# EAGLE design Sensors_v1.0 (EAGLE 7.7.0)

## Sheet 1 of 5
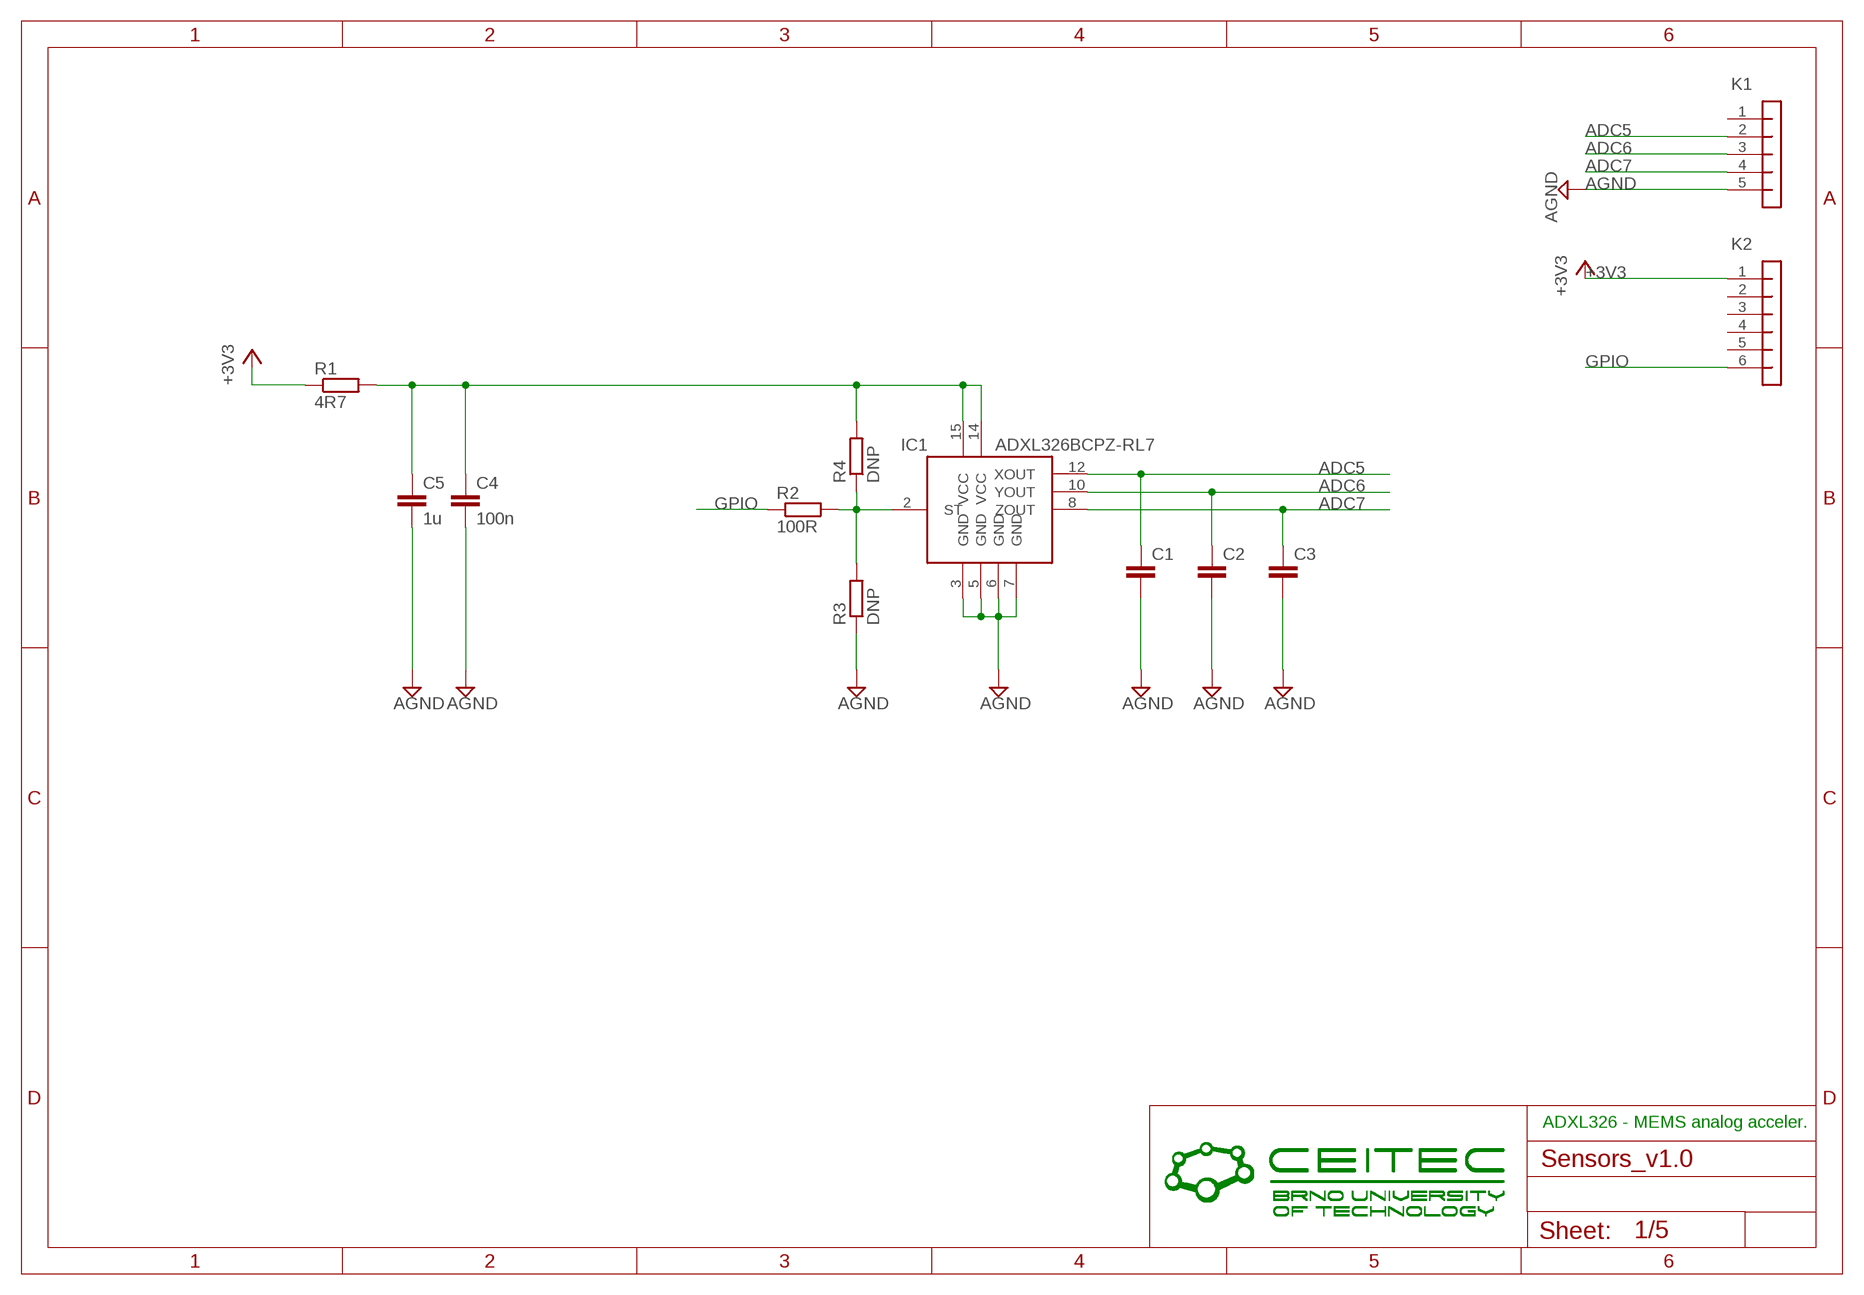
[diagram p0: schematic, sheet 1]

### Parts
C1  C-EUC0805K  [C0805K]
C2  C-EUC0805K  [C0805K]
C3  C-EUC0805K  [C0805K]
C4  100n  C-EUC0805K  [C0805K]
C5  1u  C-EUC0805K  [C0805K]
IC1  ADXL326BCPZ-RL7  ADXL326  [LFCSP-LQ-16]
K1  PIN_1X5_1.27THT  [PINHEAD_1X5_RM1.27THT]
K2  PIN_1X6_1.27THT  [PINHEAD_1X6_RM1.27THT]
R1  4R7  R-EU_M0805  [M0805]
R2  100R  R-EU_M0805  [M0805]
R3  DNP  R-EU_M0805  [M0805]
R4  DNP  R-EU_M0805  [M0805]

### Nets
+3V3: K2.1 R1.1 ; also sheet 2,3,4,5
ADC5: C1.1 IC1.12(XOUT) K1.2 ; also sheet 4
ADC6: C2.1 IC1.10(YOUT) K1.3 ; also sheet 4
ADC7: C3.1 IC1.8(ZOUT) K1.4 ; also sheet 4
AGND: C1.2 C2.2 C3.2 C4.2 C5.2 IC1.3(GND) IC1.5(GND) IC1.6(GND) IC1.7(GND) K1.5 R3.1 ; also sheet 4
GPIO: K2.6 R2.1 ; also sheet 2,3
N$1: C4.1 C5.1 IC1.14(VCC) IC1.15(VCC) R1.2 R4.2
N$2: IC1.2(ST) R2.2 R3.2 R4.1
Unconnected: K1.1 K2.2 K2.3 K2.4 K2.5

### Notes on the sheet
- ADXL326 - MEMS analog acceler.

## Sheet 2 of 5
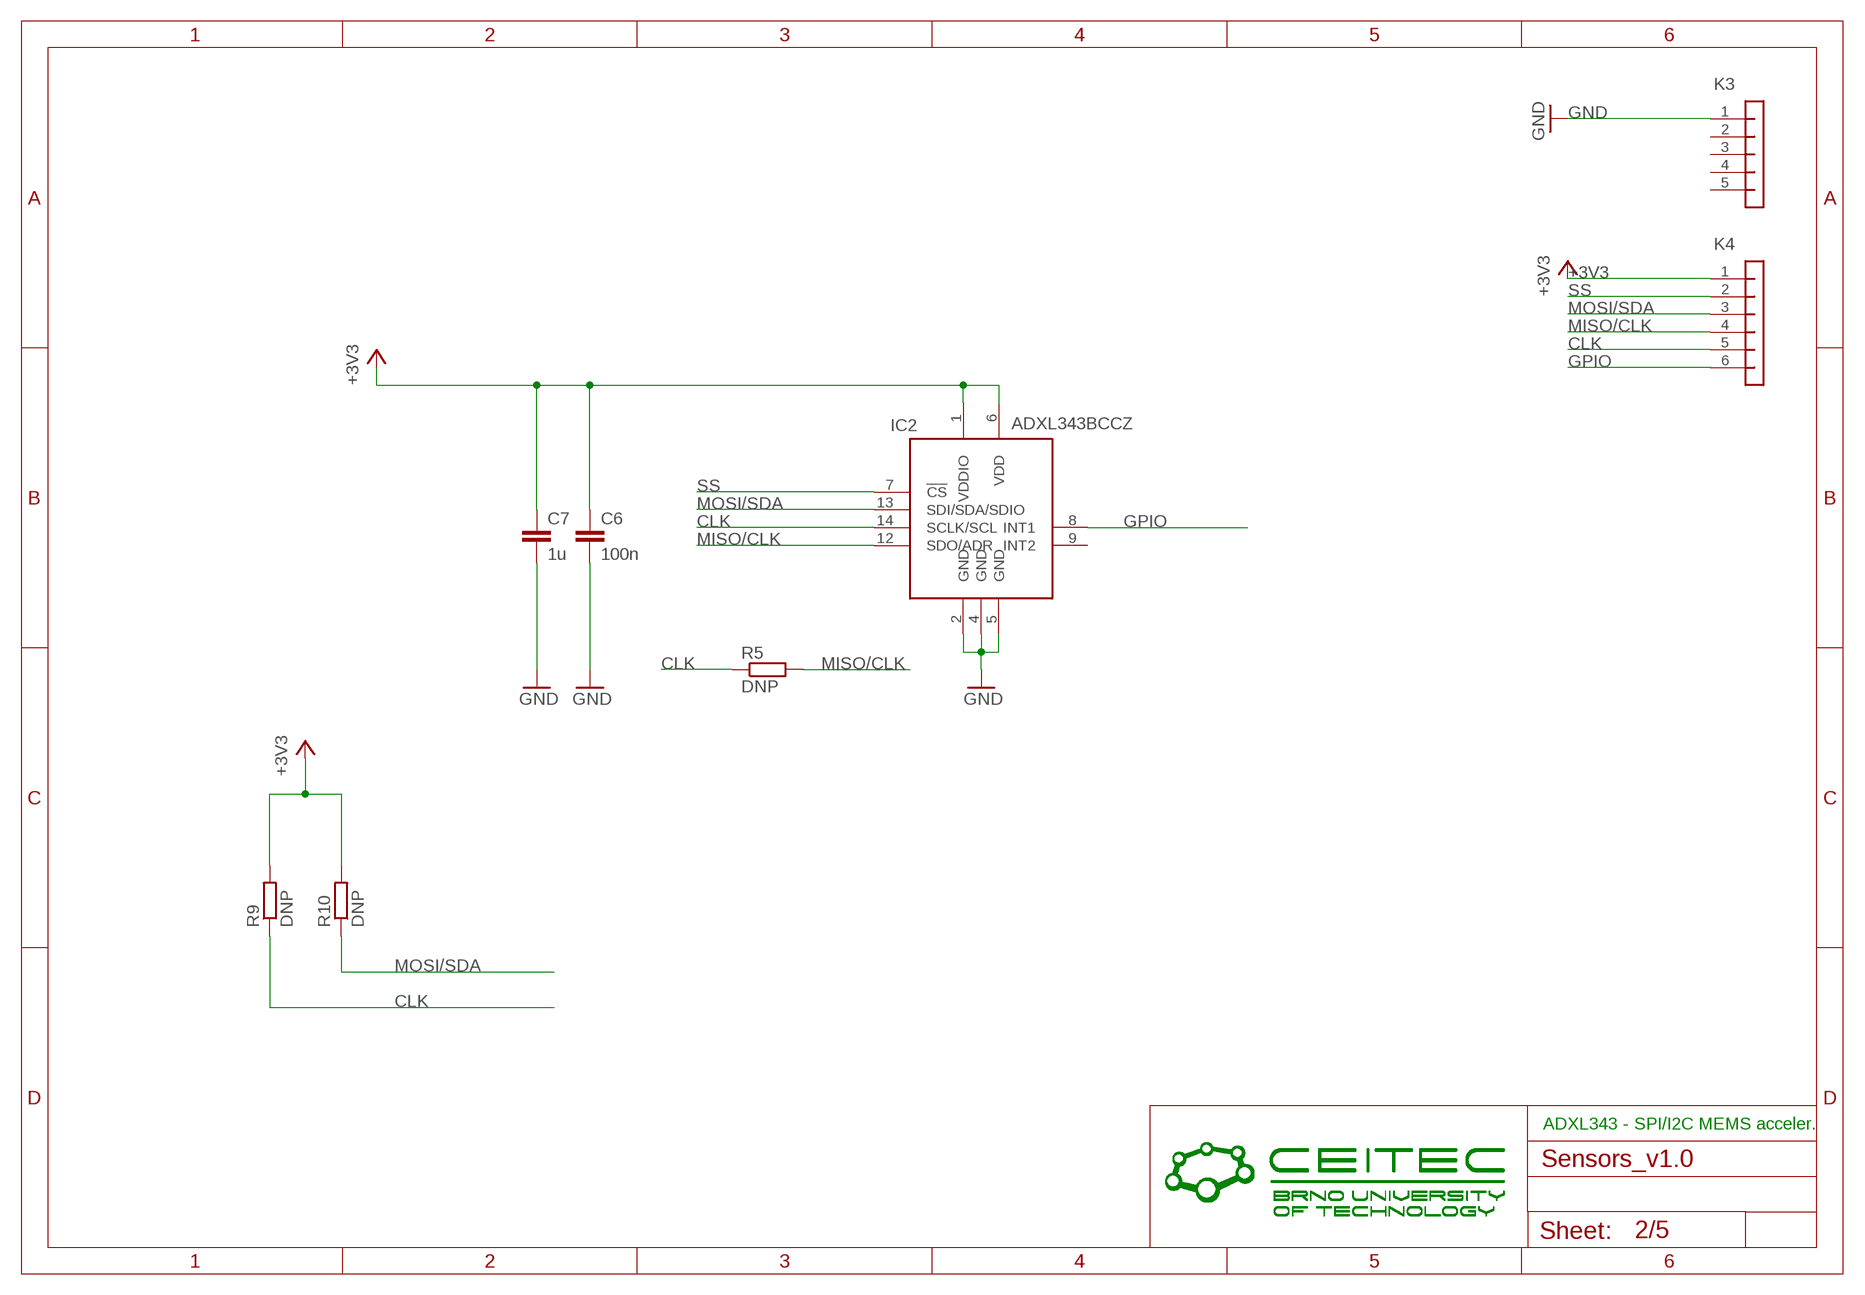
[diagram p1: schematic, sheet 2]

### Parts
C6  100n  C-EUC0805K  [C0805K]
C7  1u  C-EUC0805K  [C0805K]
IC2  ADXL343BCCZ  [LGA14(CC-14-1)]
K3  PIN_1X5_1.27THT  [PINHEAD_1X5_RM1.27THT]
K4  PIN_1X6_1.27THT  [PINHEAD_1X6_RM1.27THT]
R5  DNP  R-EU_M0805  [M0805]
R9  DNP  R-EU_M0805  [M0805]
R10  DNP  R-EU_M0805  [M0805]

### Nets
+3V3: C6.1 C7.1 IC2.1(VDDIO) IC2.6(VDD) K4.1 R9.2 R10.2 ; also sheet 1,3,4,5
CLK: IC2.14(SCLK/SCL) K4.5 R5.1 R9.1 ; also sheet 3
GND: C6.2 C7.2 IC2.2(GND) IC2.4(GND) IC2.5(GND) K3.1 ; also sheet 3,5
GPIO: IC2.8(INT1) K4.6 ; also sheet 1,3
MISO/CLK: IC2.12(SDO/ADR) K4.4 R5.2 ; also sheet 3,5
MOSI/SDA: IC2.13(SDI/SDA/SDIO) K4.3 R10.1 ; also sheet 3,5
SS: IC2.7(!CS) K4.2 ; also sheet 3
Unconnected: IC2.9(INT2) K3.2 K3.3 K3.4 K3.5

### Notes on the sheet
- ADXL343 - SPI/I2C MEMS acceler.

## Sheet 3 of 5
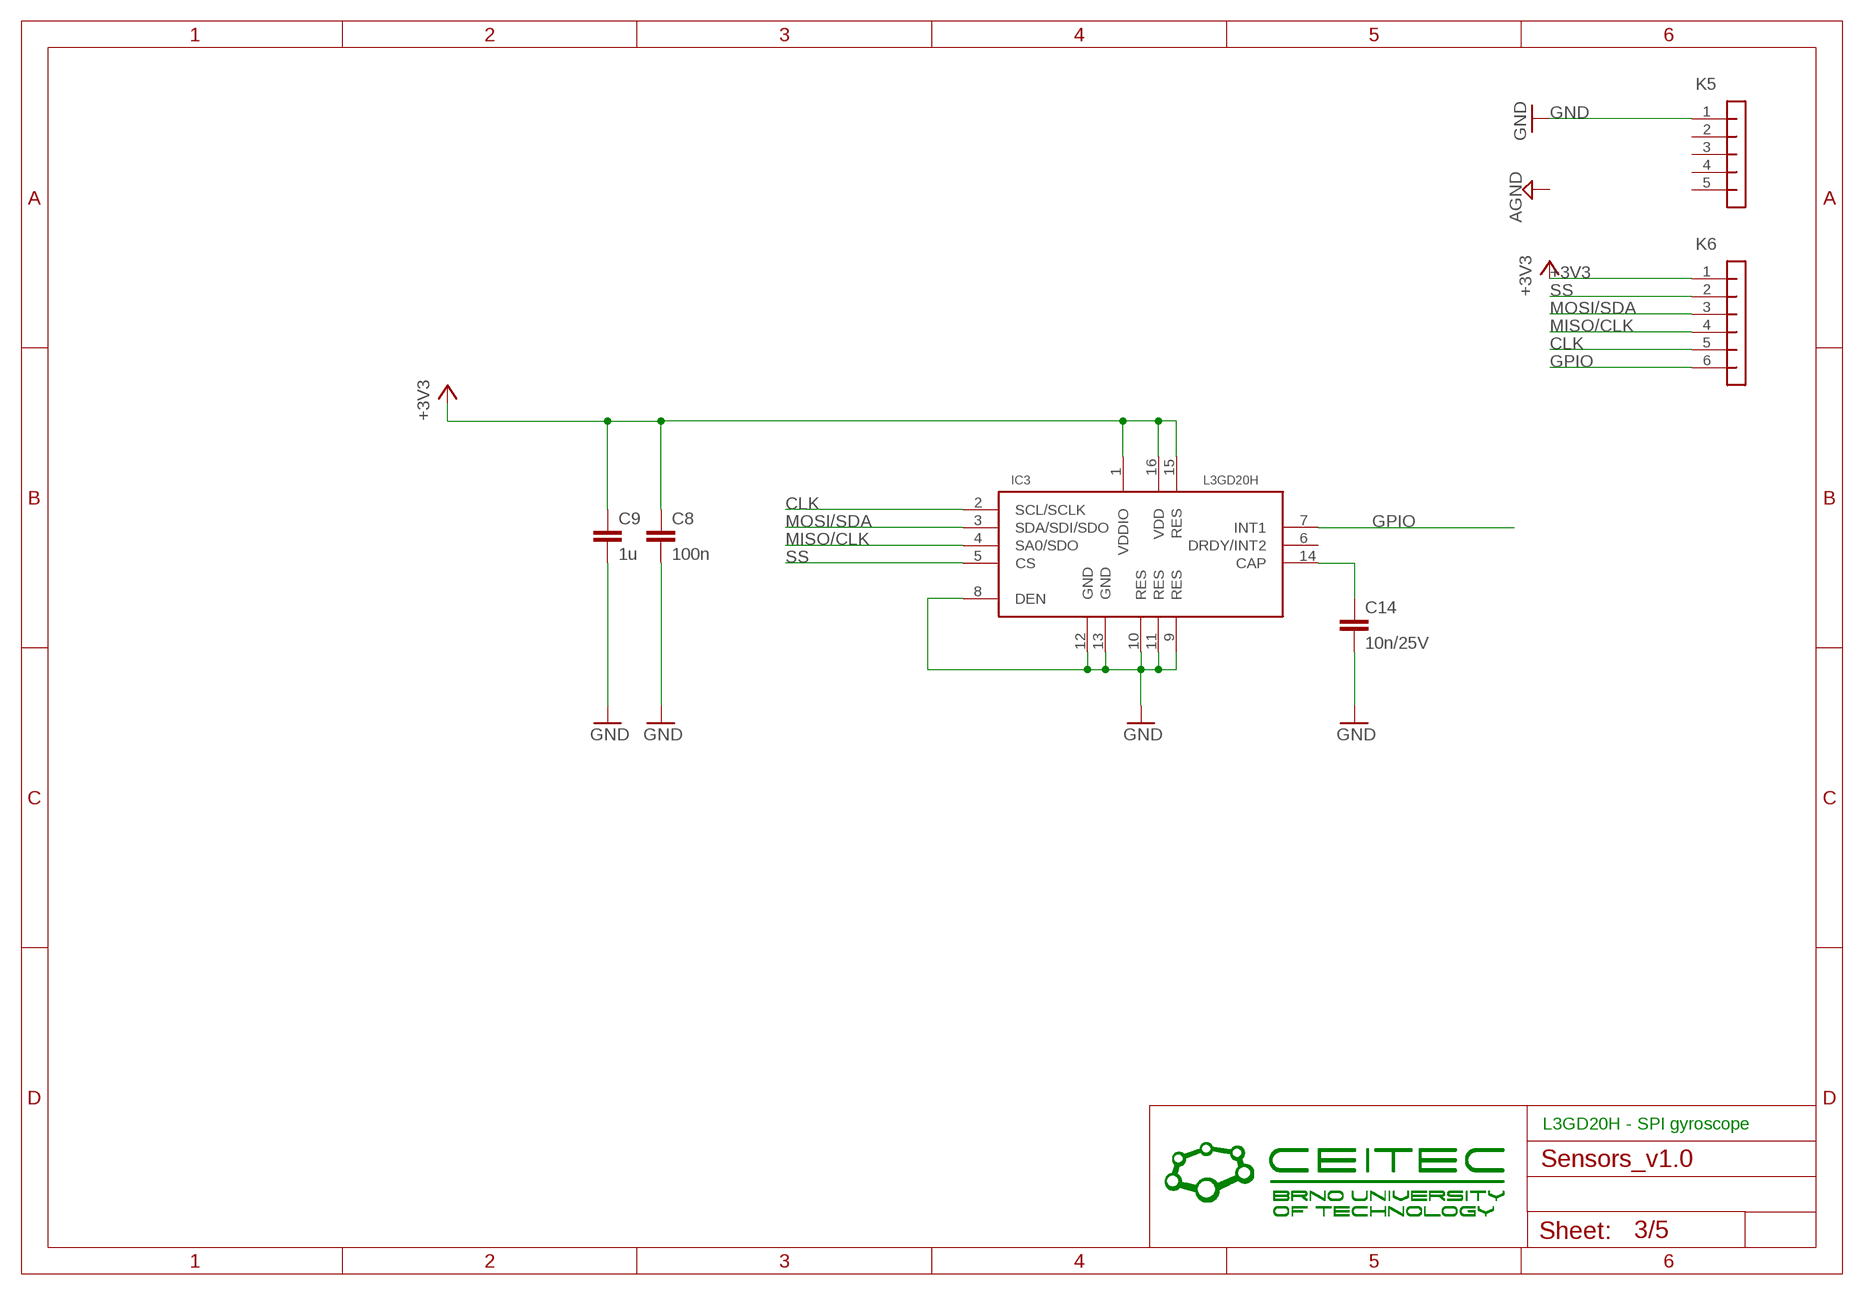
[diagram p2: schematic, sheet 3]

### Parts
C8  100n  C-EUC0805K  [C0805K]
C9  1u  C-EUC0805K  [C0805K]
C14  10n/25V  C-EUC0805K  [C0805K]
IC3  L3GD20H  [LGA16L]
K5  PIN_1X5_1.27THT  [PINHEAD_1X5_RM1.27THT]
K6  PIN_1X6_1.27THT  [PINHEAD_1X6_RM1.27THT]

### Nets
+3V3: C8.1 C9.1 IC3.1(VDDIO) IC3.15(RES) IC3.16(VDD) K6.1 ; also sheet 1,2,4,5
CLK: IC3.2(SCL/SCLK) K6.5 ; also sheet 2
GND: C8.2 C9.2 C14.2 IC3.8(DEN) IC3.9(RES) IC3.10(RES) IC3.11(RES) IC3.12(GND) IC3.13(GND) K5.1 ; also sheet 2,5
GPIO: IC3.7(INT1) K6.6 ; also sheet 1,2
MISO/CLK: IC3.4(SA0/SDO) K6.4 ; also sheet 2,5
MOSI/SDA: IC3.3(SDA/SDI/SDO) K6.3 ; also sheet 2,5
N$3: C14.1 IC3.14(CAP)
SS: IC3.5(CS) K6.2 ; also sheet 2
Unconnected: IC3.6(DRDY/INT2) K5.2 K5.3 K5.4 K5.5

### Notes on the sheet
- L3GD20H - SPI gyroscope

## Sheet 4 of 5
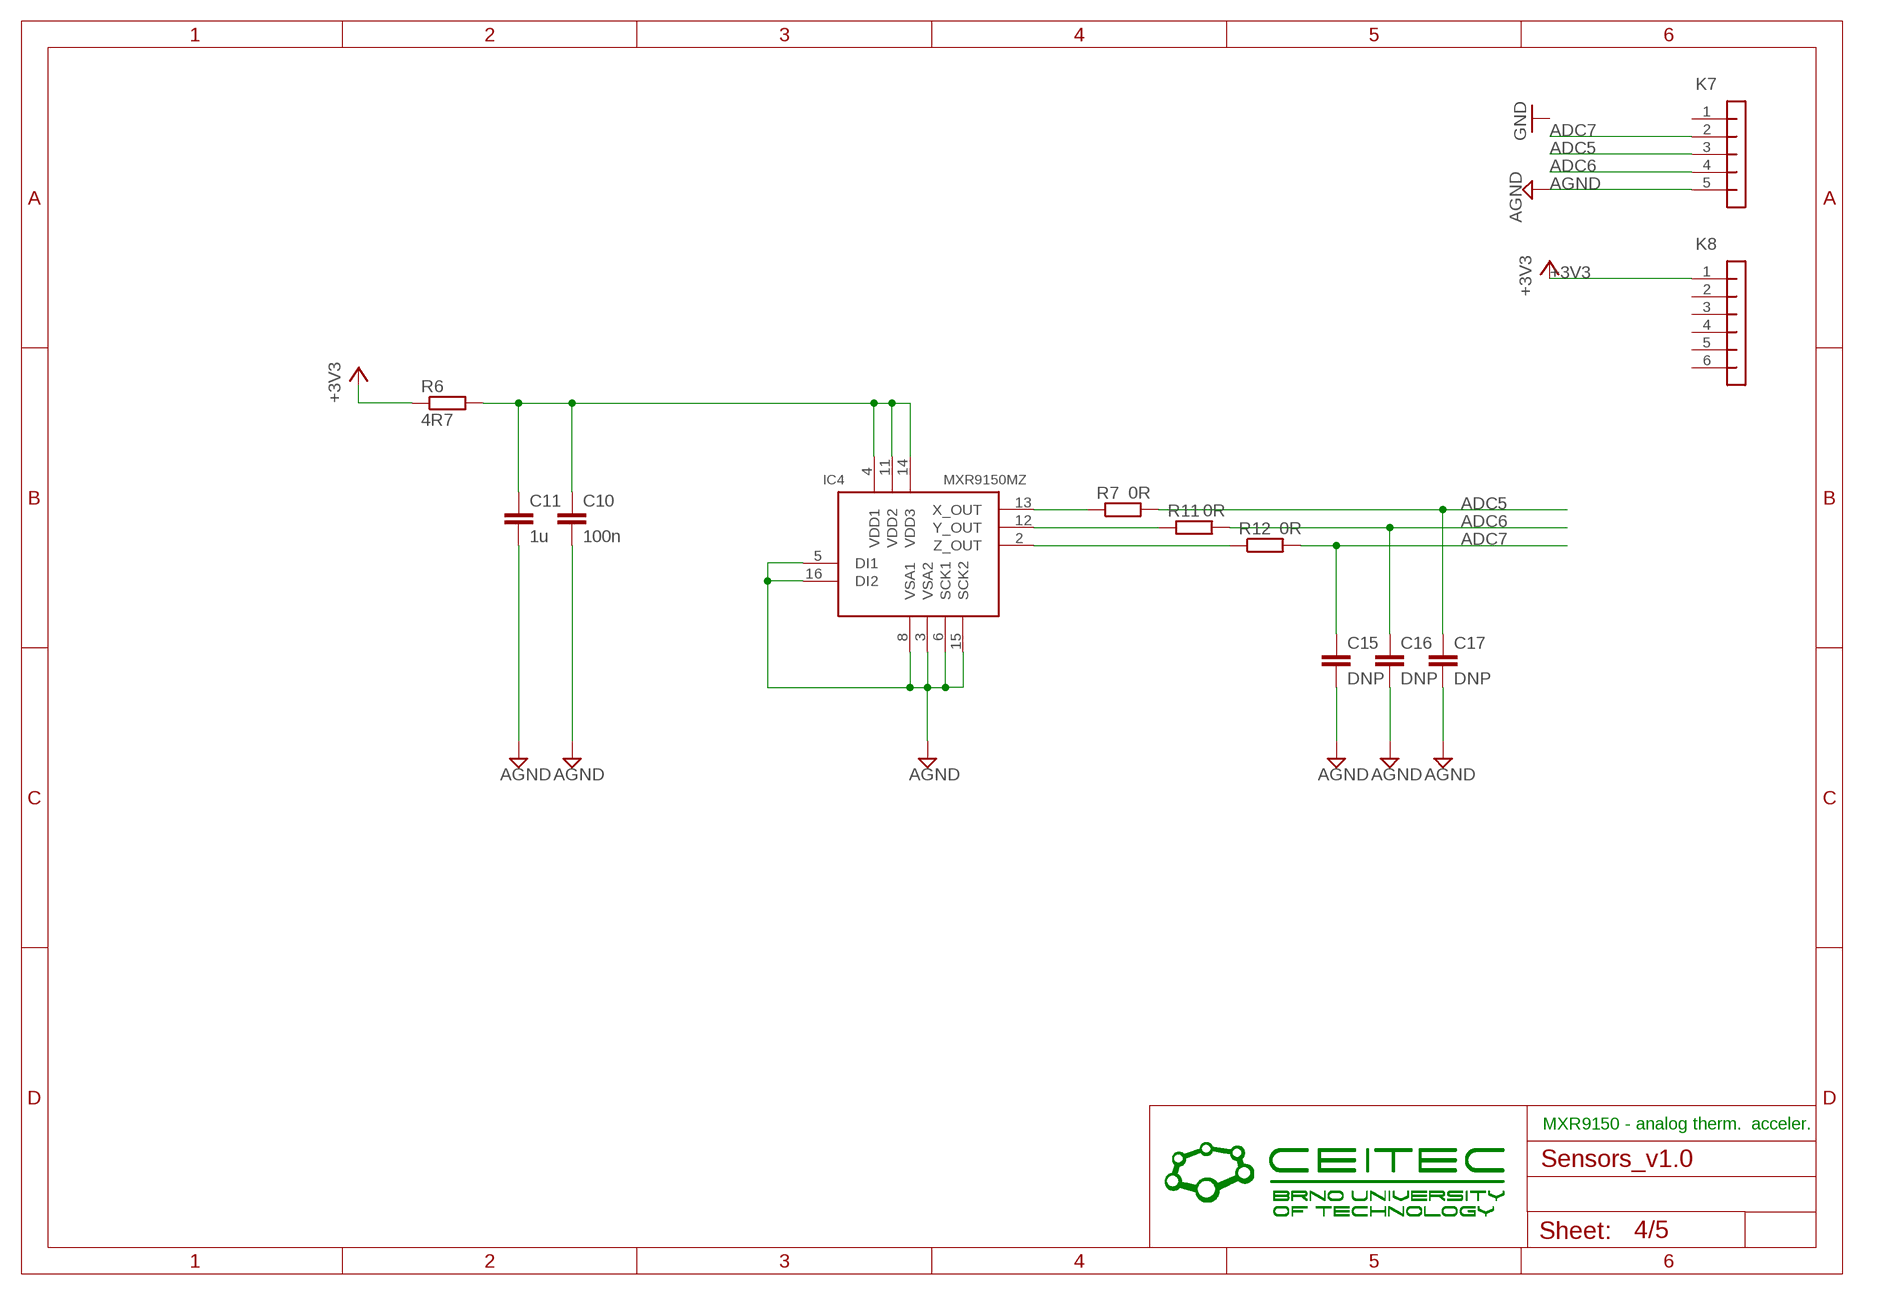
[diagram p3: schematic, sheet 4]

### Parts
C10  100n  C-EUC0805K  [C0805K]
C11  1u  C-EUC0805K  [C0805K]
C15  DNP  C-EUC0805K  [C0805K]
C16  DNP  C-EUC0805K  [C0805K]
C17  DNP  C-EUC0805K  [C0805K]
IC4  MXR9150MZ  [LCC16]
K7  PIN_1X5_1.27THT  [PINHEAD_1X5_RM1.27THT]
K8  PIN_1X6_1.27THT  [PINHEAD_1X6_RM1.27THT]
R6  4R7  R-EU_M0805  [M0805]
R7  0R  R-EU_M0805  [M0805]
R11  0R  R-EU_M0805  [M0805]
R12  0R  R-EU_M0805  [M0805]

### Nets
+3V3: K8.1 R6.1 ; also sheet 1,2,3,5
ADC5: C17.1 K7.3 R7.2 ; also sheet 1
ADC6: C16.1 K7.4 R11.2 ; also sheet 1
ADC7: C15.1 K7.2 R12.2 ; also sheet 1
AGND: C10.2 C11.2 C15.2 C16.2 C17.2 IC4.3(VSA2) IC4.5(DI1) IC4.6(SCK1) IC4.8(VSA1) IC4.15(SCK2) IC4.16(DI2) K7.5 ; also sheet 1
N$4: C10.1 C11.1 IC4.4(VDD1) IC4.11(VDD2) IC4.14(VDD3) R6.2
N$5: IC4.13(X_OUT) R7.1
N$7: IC4.12(Y_OUT) R11.1
N$8: IC4.2(Z_OUT) R12.1
Unconnected: K7.1 K8.2 K8.3 K8.4 K8.5 K8.6

### Notes on the sheet
- MXR9150 - analog therm.  acceler.

## Sheet 5 of 5
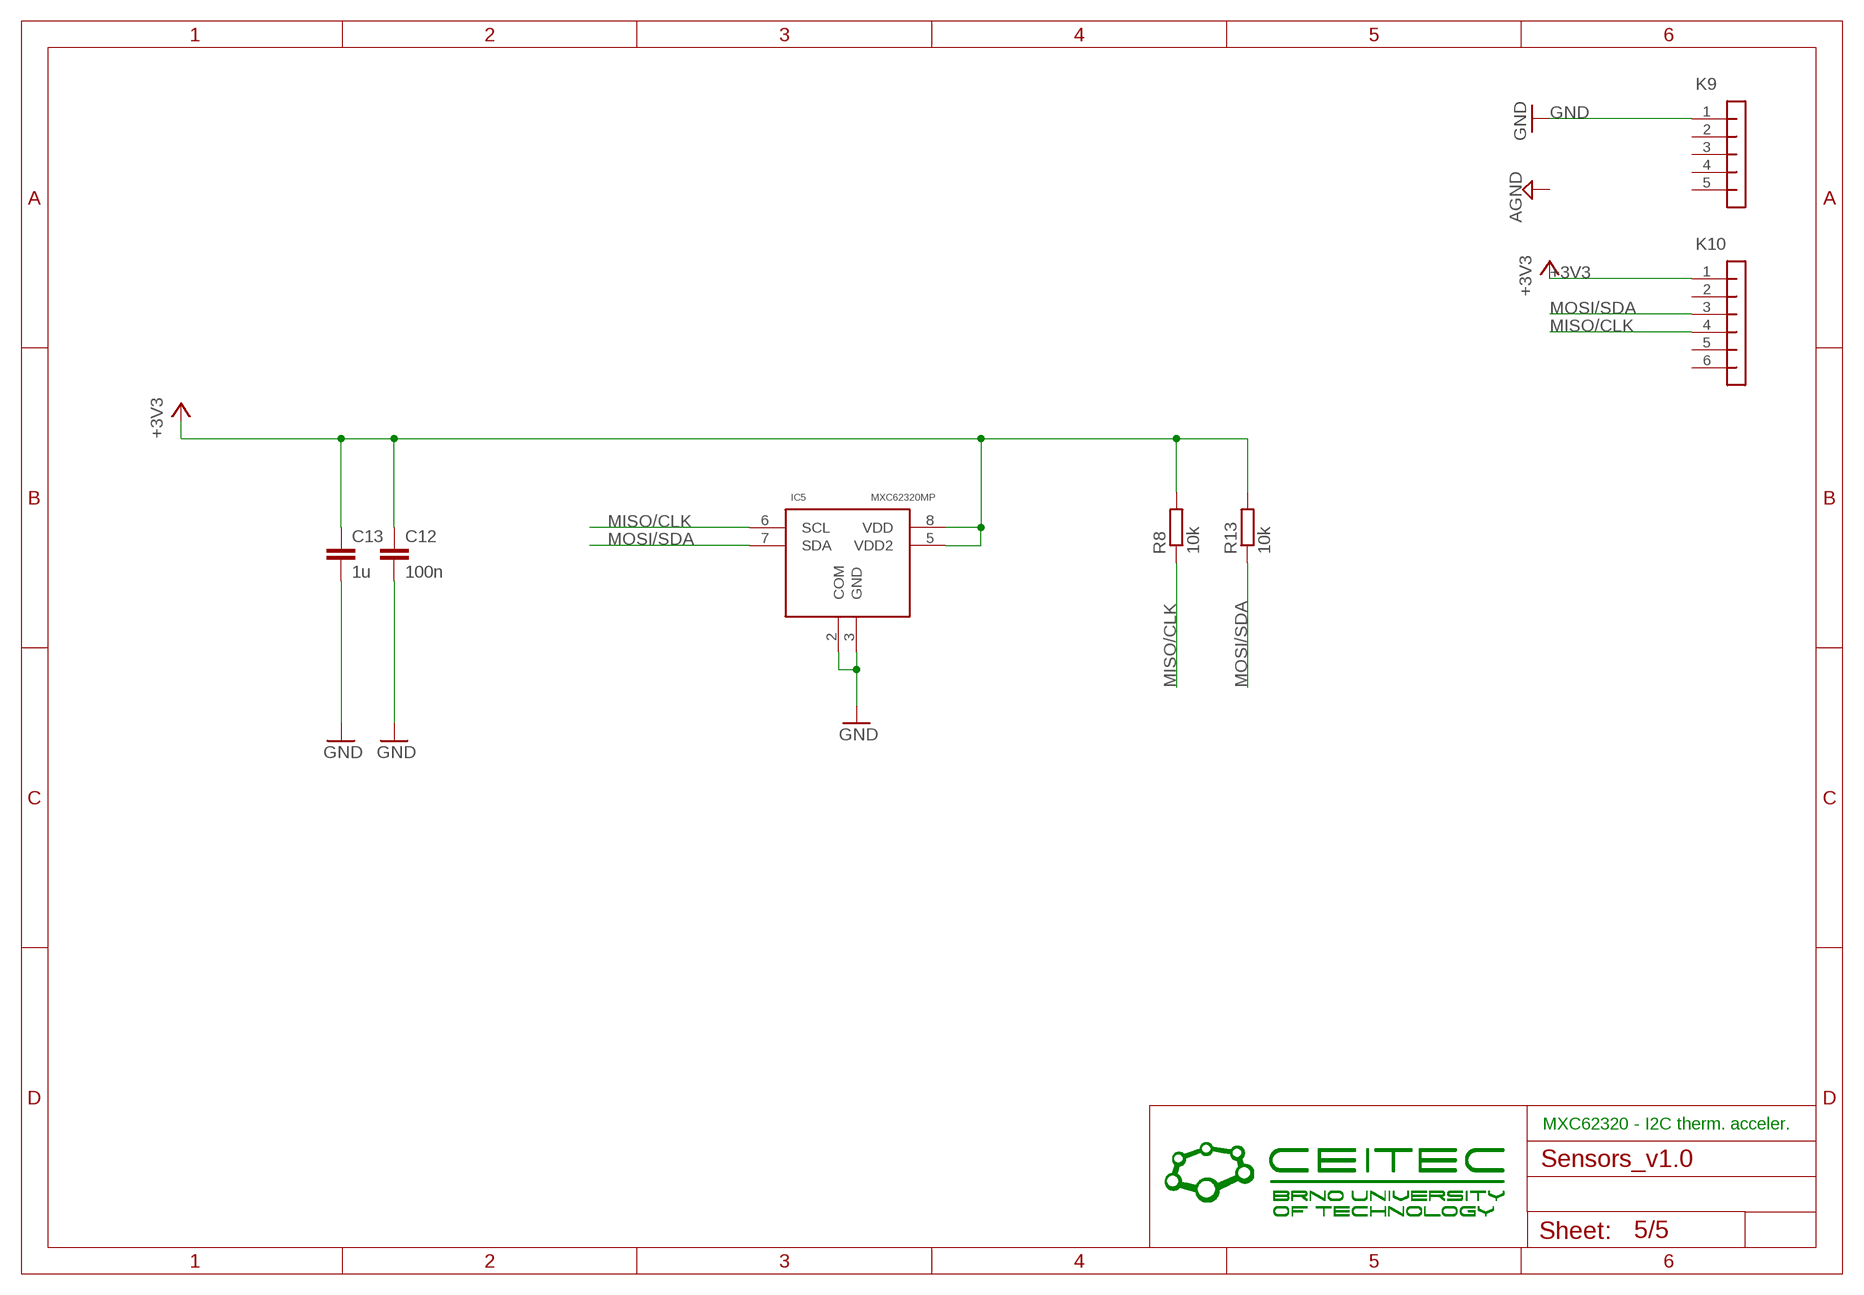
[diagram p4: schematic, sheet 5]

### Parts
C12  100n  C-EUC0805K  [C0805K]
C13  1u  C-EUC0805K  [C0805K]
IC5  MXC62320MP  [LCC8]
K9  PIN_1X5_1.27THT  [PINHEAD_1X5_RM1.27THT]
K10  PIN_1X6_1.27THT  [PINHEAD_1X6_RM1.27THT]
R8  10k  R-EU_M0805  [M0805]
R13  10k  R-EU_M0805  [M0805]

### Nets
+3V3: C12.1 C13.1 IC5.5(VDD2) IC5.8(VDD) K10.1 R8.2 R13.2 ; also sheet 1,2,3,4
GND: C12.2 C13.2 IC5.2(COM) IC5.3(GND) K9.1 ; also sheet 2,3
MISO/CLK: IC5.6(SCL) K10.4 R8.1 ; also sheet 2,3
MOSI/SDA: IC5.7(SDA) K10.3 R13.1 ; also sheet 2,3
Unconnected: K9.2 K9.3 K9.4 K9.5 K10.2 K10.5 K10.6

### Notes on the sheet
- MXC62320 - I2C therm. acceler.

## Library data of the parts
C1-C17 = rcl:C-EU: CAPACITOR, European symbol
IC1 = _dos:ADXL326
IC2 = _dos:ADXL343BCCZ
IC3 = _dos:L3GD20H
IC4 = _dos:MXR9150MZ
IC5 = _dos:MXC62320MP
K1 K3 K5 K7 K9 = _dos:PIN_1X5_1.27
K2 K4 K6 K8 K10 = _dos:PIN_1X6_1.27
R1-R13 = rcl:R-EU_: RESISTOR, European symbol

## Board
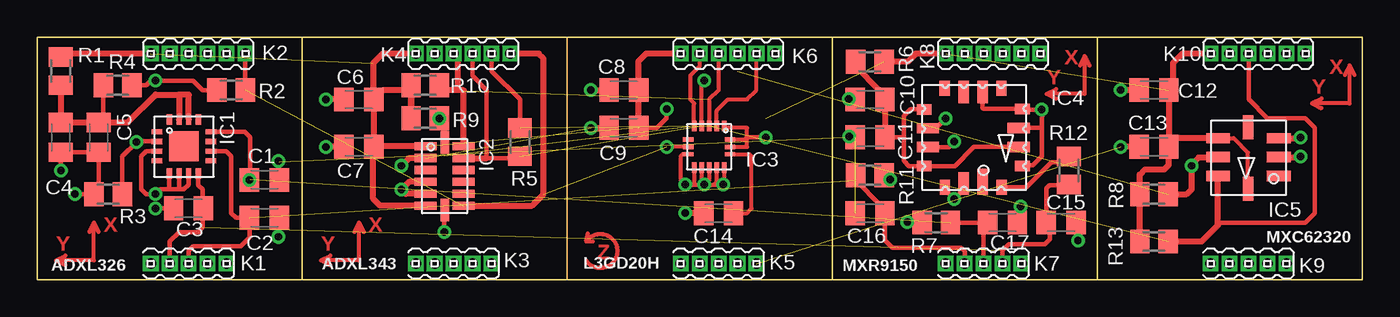
[diagram p5: board, top side]
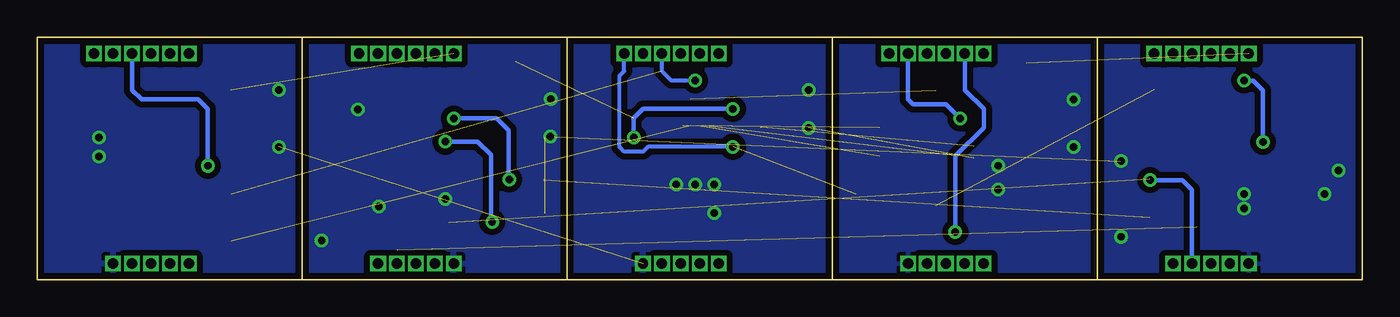
[diagram p6: board, bottom side, seen from below]

Size 88.9 x 16.26 mm. Coordinates in mm from the lower left corner, seen from the top.
Outline: 17.78,16.26 0,16.26 0,0 17.78,0
Outline: 17.78,16.26 35.56,16.26
Outline: 35.56,0 17.78,0
Outline: 17.78,0 17.78,16.26
Outline: 35.56,16.26 53.34,16.26
Outline: 53.34,0 35.56,0
Outline: 35.56,0 35.56,16.26
Outline: 53.34,16.26 71.12,16.26
Outline: 71.12,0 53.34,0
Outline: 53.34,0 53.34,16.26
Outline: 71.12,16.26 88.9,16.26 88.9,0 71.12,0
Outline: 71.12,0 71.12,16.26
Copper layers (1*16): Top 0.035mm / dielectric 1.5mm / Bottom 0.035mm
Design rules "default *": minimum track width 10mil, minimum drill 0.5mm, track to track 0.2mm, track to pad 0.2mm, pad to pad 0.2mm, via to via 0.2mm, smd to smd 0mil, copper to edge 0.2mm, drill to drill 8mil, minimum pad ring 0.125mm, minimum via ring 8mil, stop-mask expansion 4mil, vias tented up to drill 0mil, thermal gap 10mil

### Footprints (pad centres in the part's own frame; a part is rotated, then mirrored left to right if it is on the bottom)
C0805K = smd 1.3 x 1.6: 1 -1,0; 2 1,0
LFCSP-LQ-16 = smd 0.35 x 0.7: 1 -1.009,-1.805; 2 -0.359,-1.805; 3 0.291,-1.805; 4 0.941,-1.805; 9 0.941,1.82; 10 0.291,1.82; 11 -0.359,1.82; 12 -1.009,1.82 | smd 0.7 x 0.35: 5 1.785,-0.974; 6 1.785,-0.324; 7 1.785,0.326; 8 1.785,0.976; 13 -1.84,0.976; 14 -1.84,0.326; 15 -1.84,-0.324; 16 -1.84,-0.974 | smd 2 x 2: P$1 -0.04,0
LGA14(CC-14-1) = smd 0.55 x 1.5: 1 -1.952,-1.242; 2 -1.153,-1.242; 3 -0.352,-1.242; 4 0.448,-1.242; 5 1.248,-1.242; 6 2.047,-1.242; 8 2.047,1.307; 9 1.248,1.307; 10 0.448,1.307; 11 -0.352,1.307; 12 -1.153,1.307; 13 -1.952,1.307 | smd 1.5 x 0.55: 7 2.344,0.042; 14 -2.206,0.042
LGA16L = smd 0.3 x 0.7: 1 -1,-1.41; 2 -0.5,-1.41; 3 0,-1.41; 4 0.5,-1.41; 5 1,-1.41; 9 1,1.4; 10 0.5,1.4; 11 0,1.4; 12 -0.5,1.4; 13 -1,1.4 | smd 0.7 x 0.3: 6 1.4,-0.5; 7 1.4,0; 8 1.4,0.5; 14 -1.4,0.5; 15 -1.4,0; 16 -1.4,-0.5
LCC16 = smd 1.75 x 0.7: 1 2.975,0.58 | smd 1 x 0.7: 2 3.35,1.85; 7 -3.29,1.83; 10 -3.29,-1.98; 15 3.35,-1.96 | smd 0.7 x 1: 3 1.91,3.24; 6 -1.9,3.24; 11 -1.88,-3.35; 14 1.93,-3.35 | smd 0.7 x 1.5: 4 0.64,2.99; 5 -0.63,2.99; 12 -0.61,-3.1; 13 0.66,-3.1 | smd 1.5 x 0.7: 8 -3.04,0.56; 9 -3.04,-0.71; 16 3.1,-0.69
LCC8 = smd 0.7 x 1.6: 1 -1.33,-2.03; 2 -0.06,-2.03; 3 1.21,-2.03; 5 1.21,2.05; 6 -0.06,2.05; 7 -1.33,2.05 | smd 1.6 x 0.7: 4 1.95,0.04; 8 -2.17,0.04
PINHEAD_1X5_RM1.27THT = drill 0.7 pad 1.016 square: 1 -2.54,0; 2 -1.27,0; 3 0,0; 4 1.27,0; 5 2.54,0
PINHEAD_1X6_RM1.27THT = drill 0.7 pad 1.016 square: 1 -3.175,0; 2 -1.905,0; 3 -0.635,0; 4 0.635,0; 5 1.905,0; 6 3.175,0
M0805 = smd 1.3 x 1.6: 1 -0.95,0; 2 0.95,0

### Placement (x,y rotation side)
C1  15.23,6.69 0 top
C2  15.23,4.15 0 top
C3  10.15,4.78 180 top
C4  1.58,9.54 270 top
C5  4.12,9.54 270 top
C6  21.58,12.08 180 top
C7  21.58,8.91 180 top
C8  39.36,12.72 180 top
C9  39.36,10.18 180 top
C10  55.87,12.08 180 top
C11  55.87,9.54 180 top
C12  74.92,12.72 180 top
C13  74.92,8.91 180 top
C14  45.71,4.46 180 top
C15  68.69,3.83 0 top
C16  55.87,4.46 180 top
C17  64.76,3.83 0 top
IC1  9.84,8.91 270 top
IC2  27.3,7 270 top
IC3  45.08,8.91 180 top
IC4  62.86,9.54 270 top
IC5  81.27,8.27 90 top
K1  10.15,1.07 180 top
K2  10.79,15.16 0 top
K3  27.93,1.07 180 top
K4  28.57,15.16 0 top
K5  45.71,1.07 180 top
K6  46.35,15.16 0 top
K7  63.49,1.07 180 top
K8  64.13,15.16 0 top
K9  81.27,1.07 180 top
K10  81.91,15.16 0 top
R1  1.58,13.99 270 top
R2  13.01,12.72 180 top
R3  4.76,5.73 0 top
R4  5.39,13.04 180 top
R5  32.38,9.23 270 top
R6  55.87,14.62 180 top
R7  60.32,3.83 0 top
R8  74.92,5.73 180 top
R9  26.03,10.81 180 top
R10  26.03,13.04 180 top
R11  55.87,7 180 top
R12  69.21,7.32 270 top
R13  74.92,2.56 180 top

### Tracks (layer width: path | path; a pad name or v marks a point on that pad's centre or on a via)
+3V3  (via drill 0.5)  (5 unrouted)
  Top 0.254: IC3.15 47.62,8.91 47.62,9.54 | 47.62,9.54 47.62,10.18 46.22,10.18 IC3.1 | IC3.16 47.48,9.41 47.62,9.54 | IC5.8 81.23,8.51 80.27,9.48 IC5.5
  Top 0.305: C9.1 41.59,10.18 42.22,10.81 v42.22,11.45 | v48.89,9.54 47.62,9.54
  Top 0.406: K2.1 1.9,15.16 R1.1 | K4.1 23.17,15.16 22.54,14.52 22.54,12.13 C6.1 | C6.1 C7.1 | IC2.1 22.63,8.96 C7.1 | IC2.6 23,4.96 22.54,5.42 22.54,8.86 C7.1 | R10.2 R9.2 25.08,12.4 24.76,12.72 23.22,12.72 C6.1 | K6.1 40.85,15.16 40.32,14.62 40.32,10.23 C8.1 | K8.1 58.95,15.16 58.41,14.62 R6.1 | K10.1 76.83,15.16 76.19,14.52 76.19,12.99 C12.1 C13.1 | IC5.5 76.5,9.48 C13.1 | R13.2 R8.2 73.97,7.05 74.32,7.39 75.61,7.39 75.92,7.7 C13.1
  Bottom 0.305: v42.22,11.45 48.25,11.45 48.89,10.81 v48.89,9.54
ADC5  (via drill 0.5)  (1 unrouted)
  Top 0.305: IC1.12 13.91,9.92 14.28,9.54 14.28,7.64 | 14.28,7.64 14.28,6.73 C1.1 14.28,7.64 | R7.2 C17.1 63.49,3.56 K7.3
  Bottom 0.305: C1.1 13.92,6.67 12.06,6.67 11.42,6.03 K1.2
  other vias: 14.23,6.69
ADC6  (1 unrouted)
  Top 0.305: IC1.10 12.67,8.62 13.01,8.27 13.01,4.46 13.33,4.15 C2.1 14.23,2.83 13.65,2.24 10.47,2.24 10.15,1.92 K1.3 | R11.2 54.92,6.65 56.54,5.04 56.54,4.8 C16.1 56.89,4.45 56.89,2.64 57.39,2.14 61.98,2.14 62.22,1.89 K7.4
ADC7  (1 unrouted)
  Top 0.305: IC1.8 10.81,6.35 11.11,6.05 11.11,4.19 C3.1 11.11,4.1 11.11,3.51 10.79,3.19 9.52,3.19 8.88,2.56 K1.4 | K7.2 64.76,1.96 65.19,2.38 67.61,2.38 67.93,2.69 67.93,3.8 C15.1 67.69,6.13 67.89,6.33 69.17,6.33 R12.2
AGND  (via drill 0.5)  (2 unrouted)
  Top 0.305: v1.58,7.32 C4.2 C5.2 4.12,6.05 R3.1 v2.53,5.73 | IC1.3 7.32,8.62 6.98,8.27 6.98,6.05 7.3,5.73 v7.93,5.73 8.25,6.05 8.88,6.05 | IC1.7 10.16,6.38 9.84,6.05 9.52,6.05 | 9.52,6.05 8.88,6.05 | IC1.5 8.86,6.07 8.88,6.05 | IC1.6 9.51,6.06 9.52,6.05 | C3.2 v7.93,4.78 | C1.2 16.23,7.91 v16.19,7.96 | C2.2 16.23,2.92 v16.19,2.88 | v54.44,12.12 54.14,12.08 C10.2 | v54.48,9.61 54.18,9.54 C11.2 | IC4.3 66.1,7.68 66.81,7.68 67.42,8.28 67.42,9.97 67.41,10.18 | IC4.5 67.41,10.18 | 67.41,10.18 67.41,10.45 67.43,11.36 v67.38,11.4 66.1,11.4 IC4.6 63.49,11.45 63.42,11.52 IC4.8 | C17.2 65.76,4.66 v65.99,4.89 | C15.2 69.89,2.54 v69.82,2.61 | IC4.15 60.9,6.04 v61.53,5.41 62.17,6.05 IC4.16
  pour Bottom (isolate 0.406, rank 2): -0.01,16.53 17.77,16.53 17.77,-0.62 -0.01,-0.62
  pour Bottom (isolate 0.406, rank 2): 53.33,16.53 70.81,16.53 70.81,-0.62 53.33,-0.62
CLK  (via drill 0.5)  (1 unrouted)
  Top 0.254: IC3.2 45.58,11.31 46.35,12.08 47.62,12.08 48.25,12.72 K6.5
  Top 0.305: v26.98,10.81 R9.1 27.34,10.81 | K4.5 30.47,13.99 32.38,12.08 R5.1
  Top 0.406: IC2.14 27.34,10.45 | 27.34,10.81 27.34,10.45 | 27.34,10.45 R9.1
  Bottom 0.305: K4.5 30.47,12.08 30.16,11.77 27.93,11.77 v26.98,10.81
GND  (via drill 0.5)  (2 unrouted)
  Top 0.254: IC3.8 43.31,8.41 43.17,8.27 43.17,6.69 v43.49,6.37 44.13,6.37 | IC3.13 46.08,6.42 v46.03,6.37 45.4,6.37 | 44.13,6.37 v44.76,6.37 | v44.76,6.37 45.4,6.37 | IC3.9 44.08,6.42 44.13,6.37 | IC3.10 44.58,6.55 v44.76,6.37 | IC3.11 45.08,6.69 v44.76,6.37 | IC3.12 45.58,6.55 45.4,6.37
  Top 0.406: C7.2 v19.36,8.91 | C6.2 v19.36,12.08 | IC2.5 24.74,5.76 v24.44,6.05 24.95,6.56 IC2.4 | IC2.2 24.96,8.16 v24.44,7.64 | C14.2 v43.49,4.46 | v37.14,10.18 C9.2 | v37.14,12.72 C8.2 | IC5.3 84.71,9.48 v84.77,9.54 | IC5.2 84.71,8.21 v84.77,8.27 | C13.2 v72.7,8.91 | C12.2 v72.7,12.72
  pour Bottom (isolate 0.406): 18.17,16.53 35.35,16.63 35.35,-0.52 18.17,-0.62
  pour Bottom (isolate 0.406): 35.55,16.53 53.13,16.53 53.13,0.02 35.55,0.02
  pour Bottom (isolate 0.406): 71.41,16.53 88.89,16.53 88.89,-0.62 71.51,-0.62
GPIO  (via drill 0.5)  (2 unrouted)
  Top 0.254: IC3.7 v42.22,8.91
  Top 0.305: K2.6 R2.1
  Top 0.406: IC2.8 33.19,4.96 33.97,5.73 33.97,14.84 33.65,15.16 K4.6
  Bottom 0.254: v42.22,8.91 47.94,8.91 48.25,8.59 49.52,8.59 49.84,8.91 49.84,13.67 49.52,13.99 K6.6
MISO/CLK  (via drill 0.5)  (3 unrouted)
  Top 0.254: IC3.4 44.58,13.17 v44.76,13.35
  Top 0.305: K4.4 29.2,13.67 30.16,12.72 30.16,8.16 32.26,8.16 R5.2
  Top 0.406: IC2.12 30.16,8.16 | R5.2 32.06,7.96 | R8.1 77.12,5.73 77.45,6.06 v77.45,7.64 77.45,7.72 77.93,8.2 79.21,8.2 IC5.6
  Bottom 0.254: v44.76,13.35 46.35,13.35 46.98,13.99 K6.4
  Bottom 0.305: K10.4 82.54,12.72 81.91,12.08 78.1,12.08 77.46,11.45 77.46,7.65 v77.45,7.64
MOSI/SDA  (2 unrouted)
  Top 0.254: K6.3 45.71,12.72 45.08,12.08 IC3.3
  Top 0.305: K10.3 81.27,12.08 82.54,10.81 85.08,10.81 85.72,10.18 85.72,4.46 85.08,3.83 79.22,3.83
  Top 0.406: IC2.13 28.61,12.68 28.57,12.72 28.19,12.72 | 28.19,12.72 27.3,12.72 R10.1 | R13.1 78.13,2.56 79.22,3.65 79.22,3.83 IC5.7 | K4.3 28.19,15.16 28.19,12.72
N$1
  Top 0.305: C5.1 4.44,10.86 R4.2
  Top 0.406: R1.2 C4.1 C5.1 6.07,10.54 7.93,12.4 9.52,12.4 | 9.52,12.4 IC1.15 | IC1.14 10.16,12.39 10.15,12.4 9.52,12.4
N$2  (via drill 0.5)
  Top 0.305: R4.1 7.3,13.04 7.61,13.35 v7.93,13.35 10.47,13.35 11.11,12.72 R2.2 | IC1.2 6.7,9.27 v6.66,9.23 5.71,8.28 R3.2
  Bottom 0.305: v6.66,9.23 6.66,12.72 7.3,13.35 v7.93,13.35
N$3
  Top 0.254: C14.1 47.62,4.46 47.94,4.78 47.94,8.27 47.8,8.41 IC3.14
N$4
  Top 0.305: IC4.11 58.58,11.42 58.15,11 58.15,9.54 | 58.15,9.54 58.15,7.96 58.49,7.62 IC4.14 61.56,7.61 62.86,8.91 IC4.4 | 58.15,9.54 C11.1
  Top 0.406: R6.2 54.92,14.3 56.51,12.72 56.51,12.45 C10.1 C11.1
N$5  (via drill 0.5)
  Top 0.305: IC4.13 61.16,8.88 v61.53,9.25 | v58.38,3.87 59.33,3.87 R7.1
  Bottom 0.305: v61.53,9.25 59.34,9.25 58.46,8.37 58.46,3.95 v58.38,3.87
N$6
  Top 0.254: 3.8,3.83 3.8,1.29 1.26,1.29 | 3.8,3.83 3.49,3.19 | 3.8,3.83 4.12,3.19 | 1.26,1.29 1.9,0.97 | 1.26,1.29 1.9,1.61
N$7  (via drill 0.5)
  Top 0.305: IC4.12 60.29,10.15 v60.95,10.81 | v57.24,6.71 57.12,6.71 R11.1
  Bottom 0.305: v60.95,10.81 58.07,10.81 57.29,10.03 57.29,6.75 v57.24,6.71
N$8
  Top 0.305: IC4.2 66.37,6.19 68.04,7.86 68.8,7.86 R12.1
N$9
  Top 0.254: 21.58,3.83 21.58,1.29 19.04,1.29 | 21.58,3.83 21.27,3.19 | 21.58,3.83 21.9,3.19 | 19.04,1.29 19.68,0.97 | 19.04,1.29 19.68,1.61
N$10
  Top 0.254: 36.82,2.56 arc-293 36.82,1.29 | 36.82,2.56 36.94,3.1 | 36.82,2.56 37.28,2.56
N$11
  Top 0.254: 70.28,15 70.28,12.46 67.74,12.46 | 70.28,15 69.96,14.36 | 70.28,15 70.6,14.36 | 67.74,12.46 68.37,12.14 | 67.74,12.46 68.37,12.77
N$12
  Top 0.254: 88.06,14.36 88.06,11.82 85.52,11.82 | 88.06,14.36 87.74,13.73 | 88.06,14.36 88.38,13.73 | 85.52,11.82 86.15,11.5 | 85.52,11.82 86.15,12.14
SS  (via drill 0.5)  (1 unrouted)
  Top 0.254: K6.2 44.44,14.32 43.81,13.69 43.81,12.08 44.08,11.81 IC3.5
  Top 0.305: v27.3,3.19 27.3,4.62 IC2.7
  Bottom 0.305: K4.2 26.66,12.72 25.39,11.45 25.39,10.18 26.03,9.54 26.66,8.94 27.3,8.31 v27.3,3.19

### Text on the board
Top: X | X | Y | Y | X | X | Y | Y | Z
tNames: MXC62320 | ADXL326 | ADXL343 | L3GD20H | MXR9150